# Altium schematic sheet ESP8266TV.SchDoc
size A2
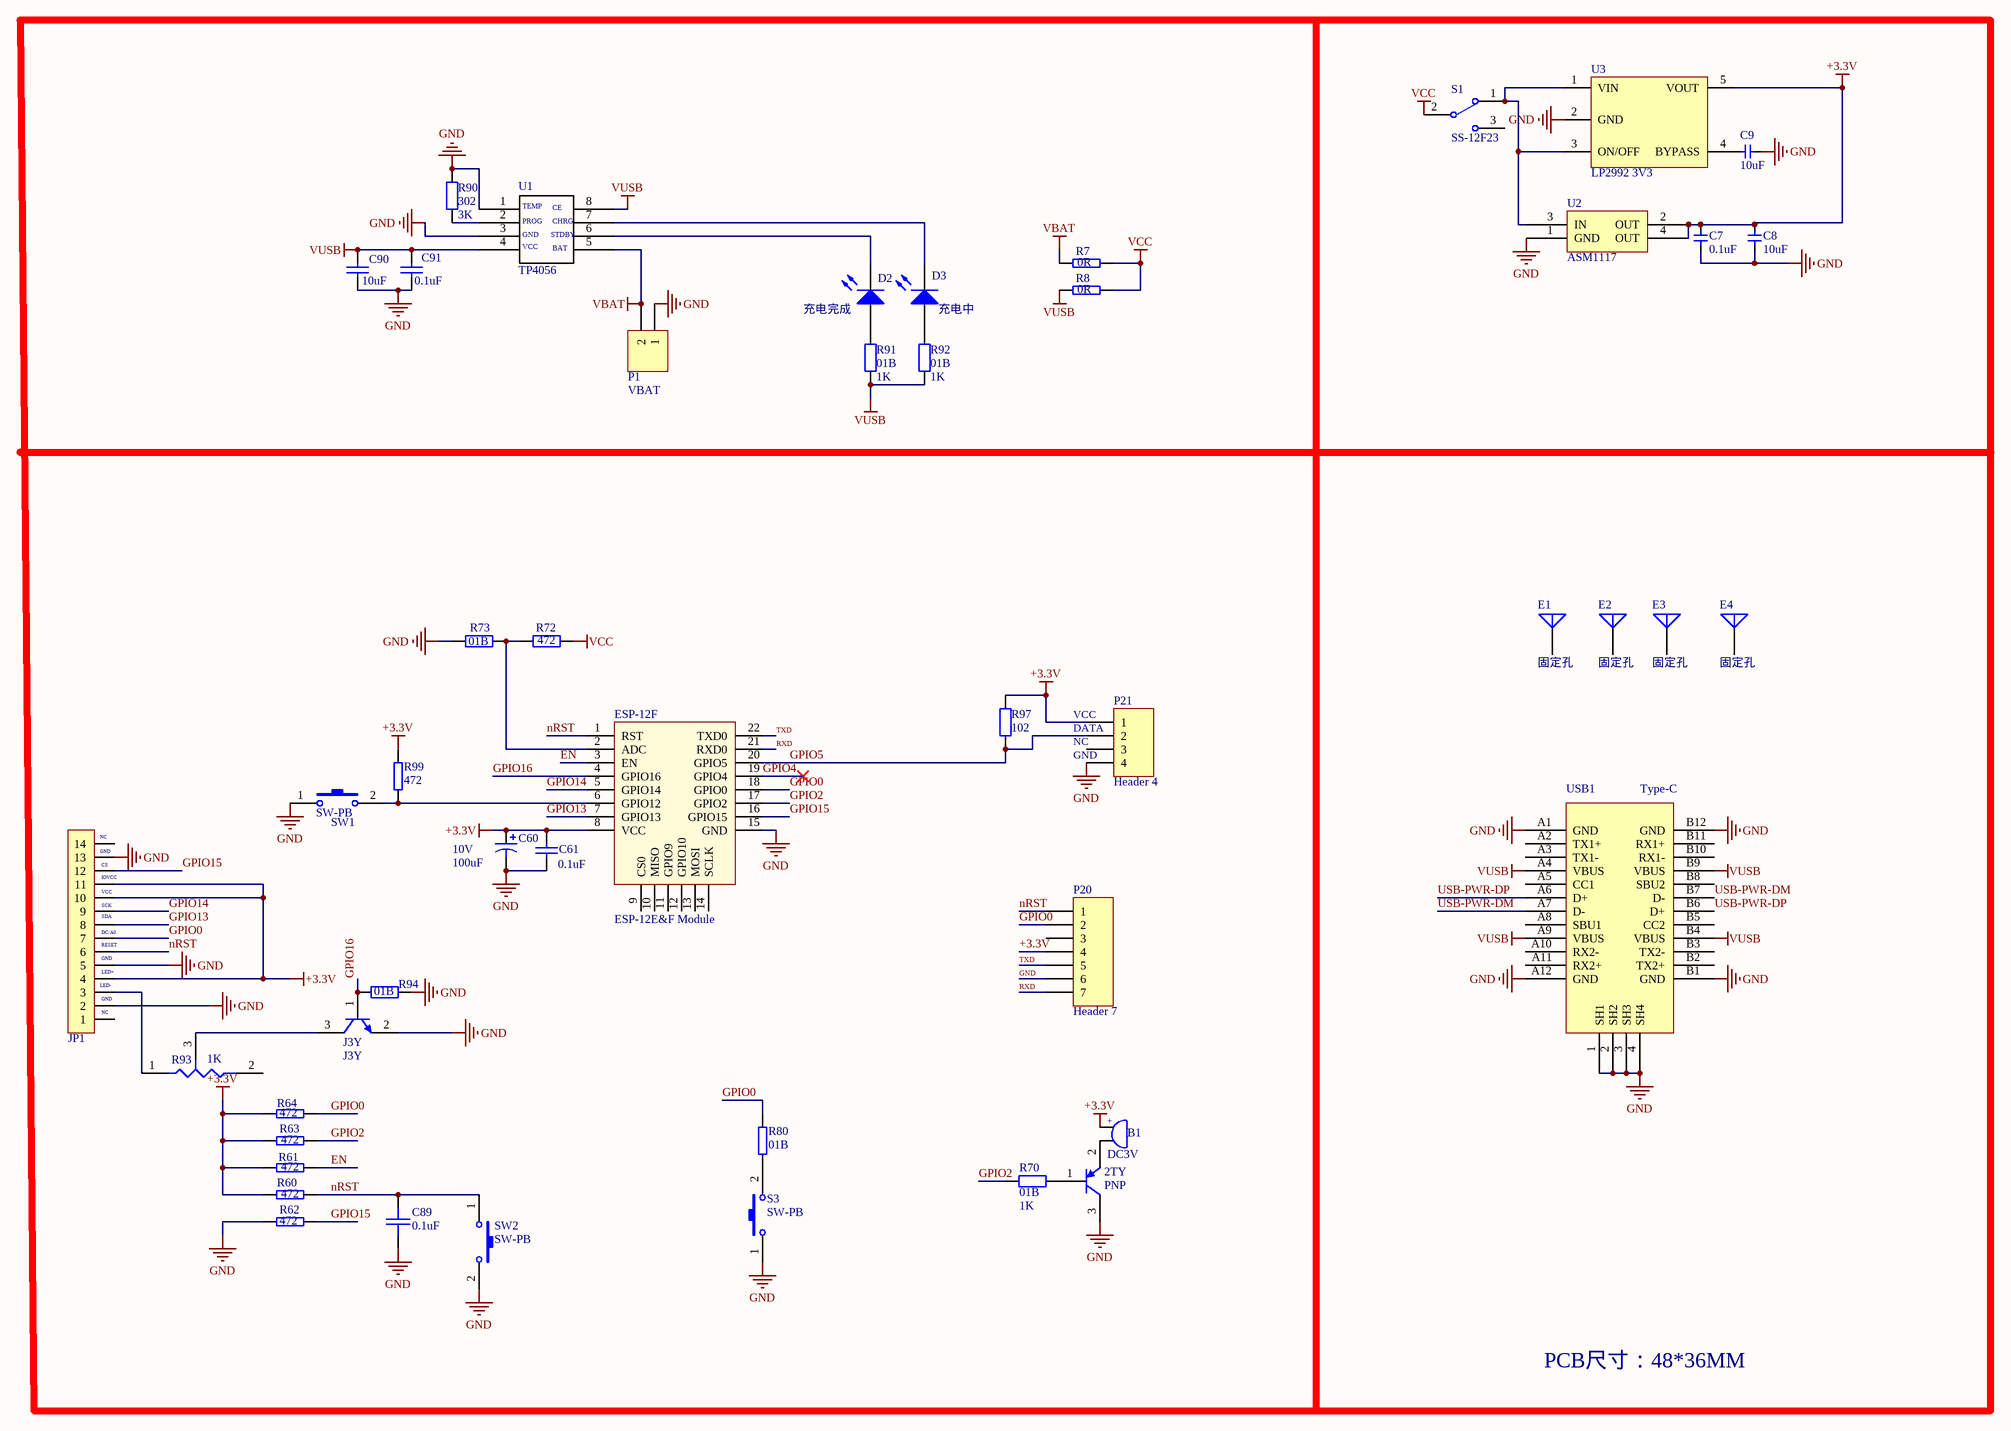
[diagram p0: ESP8266TV.SchDoc]

## Parts
2TY  PNP  [2TY]
B1  DC3V  [FM4020]
C7  0.1uF  [0603-1]
C8  10uF  [0603-1]
C9  10uF  [0603-1]
C60  10V  value 100uF  [CM C(5*5.4)]
C61  value 0.1uF  [0603-1]
C89  0.1uF  [0603-1]
C90  value 10uF  [0603-1]
C91  value 0.1uF  [0603-1]
D2  (no value)  [LED 0603G]
D3  (no value)  [LED 0603R]
E1  固定孔  [M2.2 - 3]
E2  固定孔  [M2.2 - 3]
E3  固定孔  [M2.2 - 3]
E4  固定孔  [M2.2 - 3]
ESP-12F  ESP-12E&F Module  [ESP-12E&F Module]
J3Y  J3Y  [J3Y]
JP1  FPC1.0-14P  [FPC0.5 2H-S-W-14P]  (value not drawn)
P1  VBAT  [XH2.54-2P]
P20  Header 7  [XH2.54-7P]
P21  Header 4  [HDR1X4]
R7  0R  [0603-1]
R8  0R  [0603-1]
R60  472  [0603-1]
R61  472  [0603-1]
R62  472  [0603-1]
R63  472  [0603-1]
R64  472  [0603-1]
R70  01B  value 1K  [0603-1]
R72  472  [0603-1]
R73  01B  [0603-1]
R80  01B  [0603-1]
R90  302  value 3K  [0603-1]
R91  01B  value 1K  [0603-1]
R92  01B  value 1K  [0603-1]
R93  value 1K  [R 3*3]
R94  01B  [0603-1]
R97  102  [0603-1]
R99  472  [0603-1]
S1  SS-12F23  [MSK-12C01-07]
S3  SW-PB  [SW2 _M]
SW1  SW-PB  [SW2 _M]
SW2  SW-PB  [SW2 _M]
U1  TP4056  [SOP8_N]
U2  ASM1117  [SOT-223]
U3  LP2992 3V3  [SOT23-5]
USB1  Type-C  [USB_TYPE_C_FEMALE_12_16P]

## Nets
+3.3V: B1.1 C7.2 C8.2 C60.1 C61.2 ESP-12F.8(VCC) JP1.4 JP1.10 JP1.11 P20.4 P21.1 R60.1 R61.1 R63.1 R64.1 R97.1 R99.2 U2.2(OUT) U2.4(OUT) U3.5(VOUT)
GND: 2TY.3(C) C7.1 C8.1 C9.1 C60.2 C61.1 C89.2 C90.1 C91.1 ESP-12F.15(GND) J3Y.2(E) JP1.2 JP1.5 JP1.13 P1.1 P20.6 P21.4 R62.1 R73.1 R90.1 R94.2 S3.1 SW1.1 SW2.2 U1.1 U1.3 U2.1(GND) U3.2(GND) USB1.1(SH1) USB1.2(SH2) USB1.3(SH3) USB1.4(SH4) USB1.A1(GND) USB1.A12(GND) USB1.B1(GND) USB1.B12(GND)
VBAT: P1.2 R7.2 U1.5
VCC: R7.1 R8.1 R72.2 S1.2
VUSB: C90.2 C91.2 R8.2 R91.1 R92.2 U1.4 U1.8 USB1.A4(VBUS) USB1.A9(VBUS) USB1.B4(VBUS) USB1.B9(VBUS)
EN: ESP-12F.3(EN) R61.2
GPIO0: ESP-12F.18(GPIO0) JP1.7 P20.2 R64.2 R80.2
GPIO2: ESP-12F.17(GPIO2) R63.2 R70.2
GPIO4: ESP-12F.19(GPIO4)
GPIO5: ESP-12F.20(GPIO5) P21.2 R97.2
GPIO13: ESP-12F.7(GPIO13) JP1.8
GPIO14: ESP-12F.5(GPIO14) JP1.9
GPIO15: ESP-12F.16(GPIO15) JP1.12 R62.2
GPIO16: ESP-12F.4(GPIO16) J3Y.1(B) R94.1
nRST: C89.1 ESP-12F.1(RST) JP1.6 P20.1 R60.2 SW2.1
RXD: ESP-12F.21(RXD0) P20.7
TXD: ESP-12F.22(TXD0) P20.5
USB-PWR-DM: USB1.A7(D-) USB1.B7(D-)
USB-PWR-DP: USB1.A6(D+) USB1.B6(D+)
Net2TY_1: 2TY.1(B) R70.1
Net2TY_2: 2TY.2(E) B1.2
NetC9_2: C9.2 U3.4(BYPASS)
NetD2_1: D2.1(A) R91.2
NetD2_2: D2.2(K) U1.6
NetD3_1: D3.1(A) R92.1
NetD3_2: D3.2(K) U1.7
NetESP-12F_2: ESP-12F.2(ADC) R72.1 R73.2
NetESP-12F_6: ESP-12F.6(GPIO12) R99.1 SW1.2
NetJ3Y_3: J3Y.3(C) R93.3(TAP)
NetJP1_3: JP1.3 R93.1(A)
NetR80_1: R80.1 S3.2
NetR90_2: R90.2 U1.2
NetS1_1: S1.1 U2.3(IN) U3.1(VIN) U3.3(ON/OFF)

Not connected (* = marked no-connect by the designer): E1 1(A); E2 1(A); E3 1(A); E4 1(A); ESP-12F 9(CS0) 10(MISO) 11(GPIO9) 12(GPIO10) 13(MOSI) 14(SCLK); JP1 1 14; P20 3; P21 3; R93 2(B); S1 3; USB1 A2(TX1+) A3(TX1-) A5(CC1) A8(SBU1) A10(RX2-) A11(RX2+) B2(TX2+) B3(TX2-) B5(CC2) B8(SBU2) B10(RX1-) B11(RX1+)

## Notes on the sheet
- 充电完成
- (near D3) 充电中
- (near P21) VCC
- (near P21) DATA
- (near P21) NC
- (near P21) GND
- (near JP1) NC
- (near JP1) GND
- (near JP1) SCK
- (near JP1) VCC
- (near JP1) IOVCC
- (near JP1) CS
- (near JP1) LED+
- (near JP1) RESET
- (near JP1) DC/A0
- (near JP1) SDA
- (near JP1) LED-
- PCB尺寸：48*36MM
- (in symbol BEEP) +
- (in symbol TP4056) TEMP; CE; PROG; CHRG; GND; STDBY; VCC; BAT

## Library data of the parts
2TY = PNP: PNP Bipolar Transistor; Published: 8-Jun-2000; LatestRevisionDate: 29-May-2009; LatestRevisionNote: IPC-7351 Footprint Added.; PackageVersion: Aug-1999; PackageReference: SOT-23B; Publisher: Altium Limited; PackageDescription: 3-Pin SOT-23 Package 0.95 mm Pitch, 2.4 mm Lead Span
B1 = BEEP: 蜂鸣器; 版权归属: 源创客; BOM名称: 蜂鸣器; 学习资源: www.ooocke.com
C7 = 电容-0402: Capacitor; Value: 0.1u
C8 C9 = 电容-0603: Capacitor; Value: 0.1u
C60 = Cap Pol3: Polarized Capacitor (Surface Mount); Published: 8-Jun-2000; LatestRevisionDate: 29-May-2009; LatestRevisionNote: IPC-7351 Footprint Added.; PackageReference: C0805; Publisher: Altium Limited; PackageDescription: Chip Capacitor
C61 C90 C91 = Cap: Capacitor; Published: 8-Jun-2000; LatestRevisionDate: 17-Jul-2002; LatestRevisionNote: Re-released for DXP Platform.; PackageReference: RAD-0.3; Publisher: Altium Limited; PackageDescription: Radial Cap, Thru-Hole; 2 Leads; 0.3 in Pin Spacing
C89 = SMT_C_0402: Surface mount capacitor 0402
D2 D3 = LED0: Typical INFRARED GaAs LED; Published: 8-Jun-2000; LatestRevisionDate: 08-Jul-2005; LatestRevisionNote: Mech Layer 1 removed.; PackageReference: LED-0; Publisher: Altium Limited; PackageDescription: LED; 2 Leads
E1-E4 = Antenna: Generic Antenna; Published: 24-Mar-1999; LatestRevisionDate: 17-Jul-2002; LatestRevisionNote: Re-released for DXP Platform.; PackageReference: PIN1; Publisher: Altium Limited
J3Y = SMT_TRIODE_NPN: Surface mount NPN transistor, package SOT-23
JP1 = FPC-14P: FPC连接器; 版权归属: 源创客; BOM名称: FPC连接器; 学习资源: www.ooocke.com
P1 = Header 2: Header, 2-Pin; LatestRevisionDate: 17-Jul-2002; LatestRevisionNote: Re-released for DXP Platform.; Publisher: Altium Limited
P20 = Header 7: Header, 7-Pin; LatestRevisionDate: 17-Jul-2002; LatestRevisionNote: Re-released for DXP Platform.; Publisher: Altium Limited
P21 = Header 4: Header, 4-Pin; LatestRevisionDate: 17-Jul-2002; LatestRevisionNote: Re-released for DXP Platform.; Publisher: Altium Limited
R7 R8 R60-R64 R80 R99 = SMT_R_0402: Surface mount resistor 0402
R70 R72 R73 R90-R92 R94 R97 = Res2: Resistor; Published: 8-Jun-2000; LatestRevisionDate: 17-Jul-2002; LatestRevisionNote: Re-released for DXP Platform.; PackageReference: AXIAL-0.4; Publisher: Altium Limited; PackageDescription: Axial Device, Thru-Hole; 2 Leads; 0.4 in Pin Spacing
R93 = Res Tap: Tapped Resistor; Sim Note: Enter the Resistance value and the set point into parameter fields.; Set Position: 0.5; Published: 24-Mar-1999; LatestRevisionDate: 17-Jul-2002; LatestRevisionNote: Re-released for DXP Platform.; PackageReference: VR3; Publisher: Altium Limited; PackageDescription: Variable Resistor, Thru-Hole; 3 Leads
S1 = SSW-1P: 1路波动开关; BOM名称: 波动开关; 版权归属: 源创客; 学习资源: www.ooocke.com
S3 SW1 SW2 = SW-PB: 微动开关; Published: 24-Mar-1999; LatestRevisionDate: 17-Jul-2002; LatestRevisionNote: Re-released for DXP Platform.; PackageReference: SPST-2; Publisher: Altium Limited
U2 = ASM1117: 3.3V稳压芯片
U3 = LP2992: LDO
USB1 = USB-Type-C-TOP